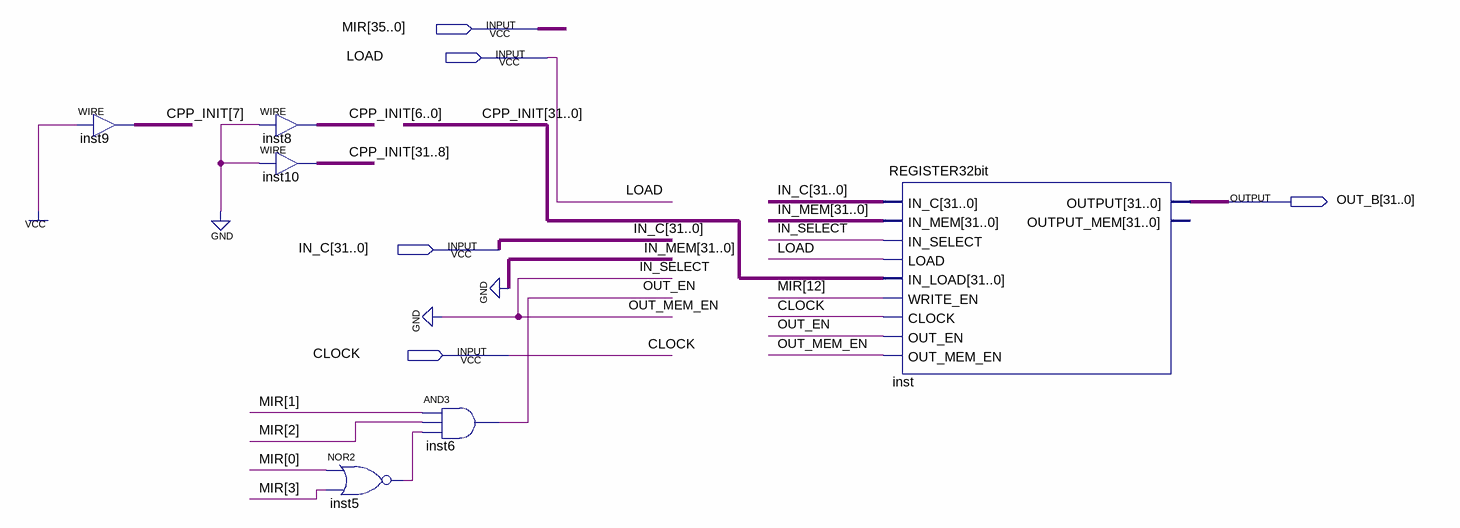
[diagram p0: schematic sheet]
// Quartus schematic CPP.bdf as structural Verilog: 6 symbols, 5 pins
module CPP (
  input  [35:0] MIR,
  input  LOAD,
  input  [31:0] IN_C,
  input  CLOCK,
  output [31:0] OUT_B
);

  wire inst5_out, OUT_EN;
  wire [31:0] CPP_INIT;

  assign CPP_INIT[7] = 1'b1;  // WIRE inst9
  assign CPP_INIT[6:0] = {7{1'b0}};  // WIRE inst8
  assign CPP_INIT[31:8] = {24{1'b0}};  // WIRE inst10
  nor inst5 (inst5_out, MIR[0], MIR[3]);
  and inst6 (OUT_EN, MIR[1], MIR[2], inst5_out);
  REGISTER32bit inst (
    .IN_C(IN_C), .IN_MEM({32{1'b0}}), .IN_SELECT(1'b0), .LOAD(LOAD), .IN_LOAD(CPP_INIT), .WRITE_EN(MIR[12]),
    .CLOCK(CLOCK), .OUT_EN(OUT_EN), .OUT_MEM_EN(1'b0), .OUTPUT(OUT_B));  // open: OUTPUT_MEM
endmodule
